# EAGLE schematic thermostat (EAGLE 8.5.2)
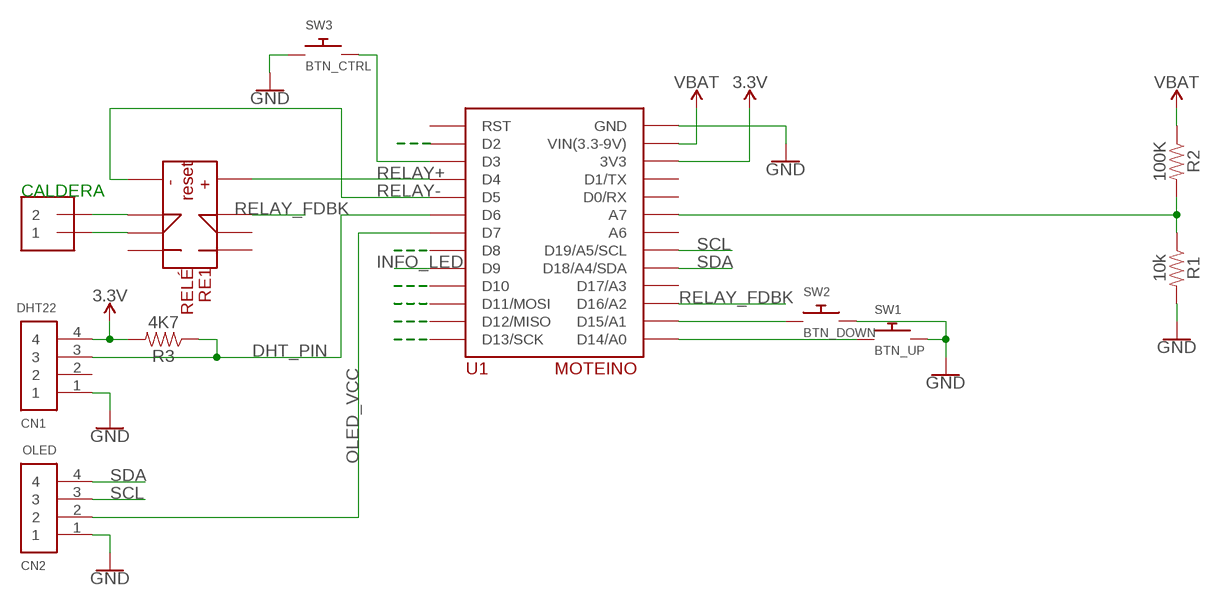
[diagram p0: schematic, sheet 1]

## Parts
CALDERA  CALDERA  1X2-3.5MM  [1X2-3.5MM]
CN1  DHT22  1X4-3.5MM  [1X04-3.5MM]
CN2  OLED  1X4-3.5MM  [1X04-3.5MM]
R1  10k  RESISTORAXIAL-0.3  [AXIAL-0.3]
R2  100K  RESISTORAXIAL-0.3  [AXIAL-0.3]
R3  4K7  RESISTORAXIAL-0.3  [AXIAL-0.3]
RE1  RELÉ  RELE_ENCL_DPDT  [RELE_ENCL_DPDT]
SW1  BTN_UP  SWITCH_PUSHBUTTONEVQ-PE  [TACT_PANA-EVQ]
SW2  BTN_DOWN  SWITCH_PUSHBUTTONEVQ-PE  [TACT_PANA-EVQ]
SW3  BTN_CTRL  SWITCH_PUSHBUTTONEVQ-PE  [TACT_PANA-EVQ]
U1  MOTEINO  [MOTENIO]

## Nets
3.3V: CN1.4 R3.P$2
DHT_PIN: CN1.3 R3.P$1 U1.P$6(D6)
FLASH_SS: U1.P$8(D8)
GND: CN1.1 CN2.1 R1.P$2 SW1.P$2 SW2.P$2 SW3.P$1 U1.P$26(GND)
INFO_LED: U1.P$9(D9)
N$1: SW3.P$2 U1.P$3(D3)
N$2: U1.P$2(D2)
N$3: R1.P$1 R2.P$2 U1.P$21(A7)
N$4: SW2.P$1 U1.P$15(D15/A1)
N$5: CALDERA.2 RE1.P$2
N$6: CALDERA.1 RE1.P$3
N$7: SW1.P$1 U1.P$14(D14/A0)
N$9: U1.P$10(D10)
N$10: U1.P$11(D11/MOSI)
N$11: U1.P$12(D12/MISO)
N$12: U1.P$13(D13/SCK)
OLED_VCC: CN2.2 U1.P$7(D7)
RELAY+: RE1.P$8 U1.P$4(D4)
RELAY-: RE1.P$1 U1.P$5(D5)
RELAY_FDBK: RE1.P$7 U1.P$16(D16/A2)
SCL: CN2.3 U1.P$19(D19/A5/SCL)
SDA: CN2.4 U1.P$18(D18/A4/SDA)
VCC: R2.P$1 U1.P$25(VIN(3.3-9V)) ; supply symbol labelled VBAT
Unconnected: CN1.2 RE1.P$4 RE1.P$5 RE1.P$6 U1.P$1(RST) U1.P$17(D17/A3) U1.P$20(A6) U1.P$22(D0/RX) U1.P$23(D1/TX)

## Notes on the sheet
- CALDERA

## Power pins joined to a net without a drawn wire
3V3: U1.P$24(3V3)

## Library data of the parts
CALDERA = adafruit:1X2: 3.5mm Terminal block http://www.ladyada.net/library/pcb/eaglelibrary.html
CN1 CN2 = adafruit:1X4: 4-pin connector
R1-R3 = SparkFun-Resistors:RESISTOR: Generic Resistor Package
RE1 = jbs-eagle-lib:RELE_ENCL_DPDT
SW1-SW3 = adafruit:SWITCH_PUSHBUTTON: Buttons SOFTTOUCHSMD_SJ - Soft touch temporary push button (Super Junk Akihabara) Compatible with SKPMANE010 [Mouser: 688-SKPMAN] C&K_KSS = Digikey: KSS221GLFS
U1 = jbs-eagle-lib:MOTEINO